# EAGLE design uSD_shield (EAGLE 6.2)
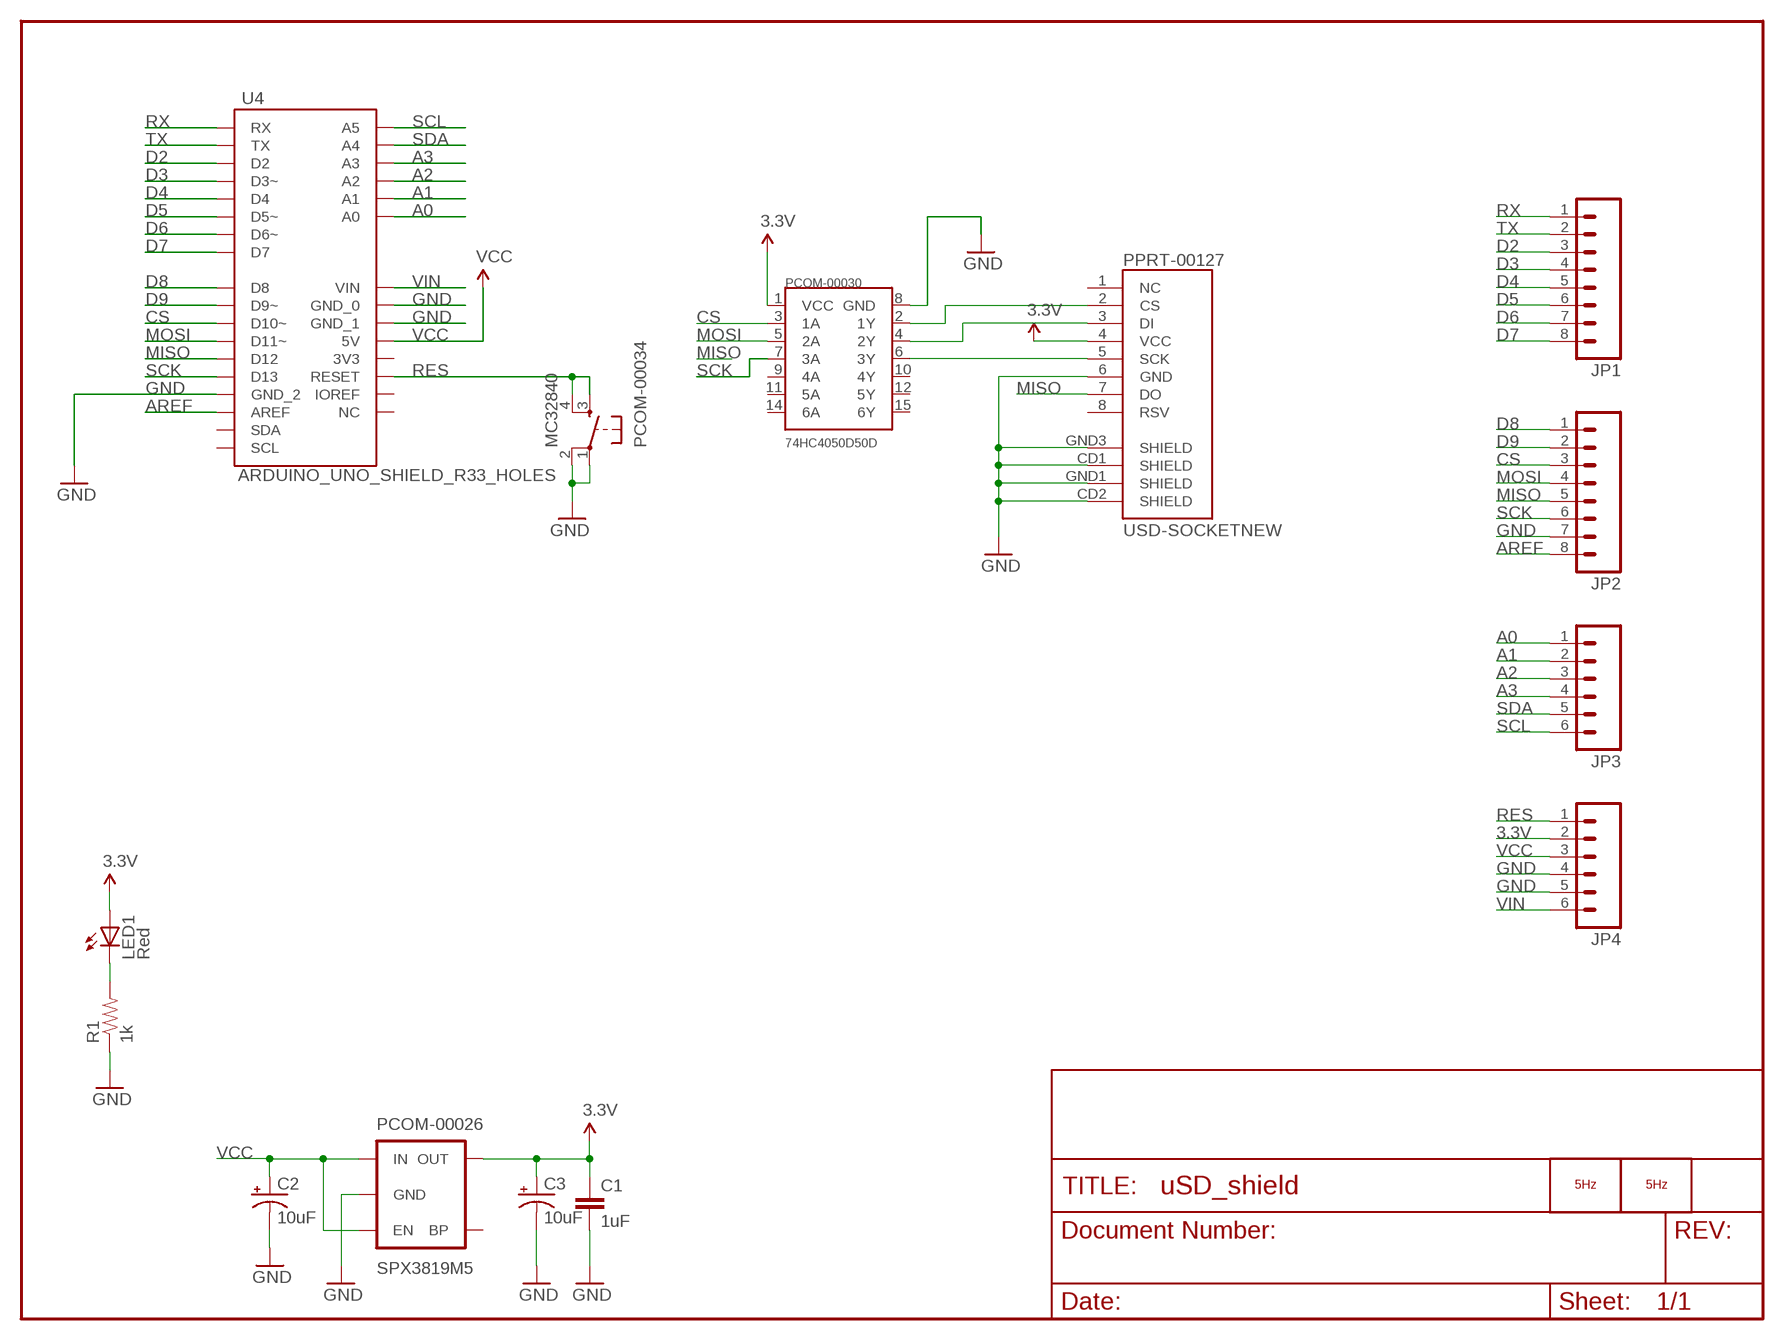
[diagram p0: schematic, sheet 1]

## Parts
C1  1uF  CAP0603-CAP  [0603-CAP]
C2  10uF  CAP_POL1206  [EIA3216]
C3  10uF  CAP_POL1206  [EIA3216]
JP1  M08  [1X08]
JP2  M08  [1X08]
JP3  M06SIP  [1X06]
JP4  M06SIP  [1X06]
LED1  Red  LED0603  [LED-0603]
LOGO2  LOGO_5HZ_MAIN_10MM  [5HZ_LOGO_MAIN_10MM]
LOGO3  LOGO_5HZ_H_COOPER_15MM  [5HZ_LOGO_H_COOPER_15MM]
PCOM-00026  SPX3819M5  V_REG_LDOSMD  [SOT23-5]
PCOM-00030  74HC4050D50D  HEX_CONVERTER  [SO016]
PCOM-00034  MC32840  TAC_SWITCHSMD  [TACTILE_SWITCH_SMD]
PPRT-00127  USD-SOCKETNEW  [MICRO-SD-SOCKET-PP]
R1  1k  RESISTOR0603-RES  [0603-RES]
U4  ARDUINO_UNO_SHIELD_R33_HOLES  [UNO_R3_SHIELD_3_HOLES_NO_SILK]

## Nets
3.3V: C1.1 C3.A(+) JP4.2 LED1.A PCOM-00026.5(OUT) PCOM-00030.1(VCC) PPRT-00127.4(VCC)
A0: JP3.1 U4.A0
A1: JP3.2 U4.A1
A2: JP3.3 U4.A2
A3: JP3.4 U4.A3
AREF: JP2.8 U4.AREF
CS: JP2.3 PCOM-00030.3(1A) U4.D10(D10~)
D2: JP1.3 U4.D2
D3: JP1.4 U4.D3(D3~)
D4: JP1.5 U4.D4
D5: JP1.6 U4.D5(D5~)
D6: JP1.7 U4.D6(D6~)
D7: JP1.8 U4.D7
D8: JP2.1 U4.D8
D9: JP2.2 U4.D9(D9~)
GND: C1.2 C2.C(-) C3.C(-) JP2.7 JP4.4 JP4.5 PCOM-00026.2(GND) PCOM-00030.8(GND) PCOM-00034.1 PCOM-00034.2 PPRT-00127.6(GND) PPRT-00127.CD1(SHIELD) PPRT-00127.CD2(SHIELD) PPRT-00127.GND1(SHIELD) PPRT-00127.GND3(SHIELD) R1.1 U4.GND_0 U4.GND_1 U4.GND_2
MISO: JP2.5 PPRT-00127.7(DO) U4.D12
MOSI: JP2.4 PCOM-00030.5(2A) U4.D11(D11~)
N$2: PCOM-00030.4(2Y) PPRT-00127.3(DI)
N$4: PCOM-00030.6(3Y) PPRT-00127.5(SCK)
N$6: LED1.C R1.2
N$163: PCOM-00030.2(1Y) PPRT-00127.2(CS)
RES: JP4.1 PCOM-00034.3 PCOM-00034.4 U4.RES(RESET)
RX: JP1.1 U4.RX
SCK: JP2.6 PCOM-00030.7(3A) U4.D13
SCL: JP3.6 U4.A5
SDA: JP3.5 U4.A4
TX: JP1.2 U4.TX
VCC: C2.A(+) JP4.3 PCOM-00026.1(IN) PCOM-00026.3(EN) U4.5V
VIN: JP4.6 U4.VIN
Unconnected: PCOM-00026.4(BP) PCOM-00030.9(4A) PCOM-00030.10(4Y) PCOM-00030.11(5A) PCOM-00030.12(5Y) PCOM-00030.14(6A) PCOM-00030.15(6Y) PPRT-00127.1(NC) PPRT-00127.8(RSV) U4.3.3V(3V3) U4.IOREF U4.NC U4.SCL U4.SDA

## Library data of the parts
C1 = SparkFun:CAP: Capacitor Standard 0603 ceramic capacitor, and 0.1" leaded capacitor.
C2 C3 = SparkFun:CAP_POL: Capacitor Polarized These are standard SMD and PTH capacitors. Normally 10uF, 47uF, and 100uF in electrolytic and tantalum varieties. Always verify the external diameter of the through hole cap, it varies with capacity, voltage, and manufacturer. The EIA devices should be standard.
JP1 JP2 = SparkFun:M08: Header 8 Standard 8-pin 0.1" header. Use with straight break away headers (SKU : PRT-00116), right angle break away headers (PRT-00553), swiss pins (PRT-00743), machine pins (PRT-00117), and female headers (PRT-00115).
JP3 JP4 = SparkFun:M06: Header 6 Standard 6-pin 0.1" header. Use with straight break away headers (SKU : PRT-00116), right angle break away headers (PRT-00553), swiss pins (PRT-00743), machine pins (PRT-00117), and female headers (PRT-00115). Molex polarized connector foot print use with SKU : PRT-08094 with associated crimp pins and housings. NOTES ON THE VARIANTS LOCK and LOCK_LONGPADS... This footprint was designed to help hold the alignment of a through-hole component (i.e. 6-pin header) while soldering it into place. You may notice that each hole has been shifted either up or down by 0.005 of an inch from it's more standard position (which is a perfectly straight line). This slight alteration caused the pins (the squares in the middle) to touch the edges of the holes. Because they are alternating, it causes a "brace" to hold the component in place. 0.005 has proven to be the perfect amount of "off-center" position when using our standard breakaway headers. Although looks a little odd when you look at the bare footprint, once you have a header in there, the alteration is very hard to notice. Also, if you push a header all the way into place, it is covered up entirely on the bottom side. This idea of altering the position of holes to aid alignment will be further integrated into the Sparkfun Library for other footprints. It can help hold any component with 3 or more connection pins.
LED1 = SparkFun:LED: LEDs Standard schematic elements and footprints for 5mm, 3mm, 1206, and 0603 sized LEDs. 5mm - Spark Fun Electronics SKU : COM-00529 (and others)
LOGO2 LOGO3 = 5hz-electronica:LOGO_5HZ: Logotipo 5Hz "según Pedro"
PCOM-00026 = SparkFun:V_REG_LDO: Voltage Regulator LDO Standard 150mA LDO voltage regulator in SOT-23 layout. Micrel part MIC5205. BP (by-pass) pin is used to lower output noise with 470pF cap.
PCOM-00030 = SparkFun:HEX_CONVERTER
PCOM-00034 = SparkFun:TAC_SWITCH: Momentary Switch Button commonly used for reset or general input. Spark Fun Electronics SKU : COM-00097
PPRT-00127 = SparkFun:USD-SOCKET: microSD Socket Push-push type uSD socket. Schematic element and footprint production proven. Spark Fun Electronics SKU : PRT-00127. tDoc lines correctly indicate media card edge positions when inserting (unlocked, locked, depressed).
R1 = SparkFun:RESISTOR: Resistor Basic schematic elements and footprints for 0603, 1206, and PTH 1/10th watt (small) resistors.
U4 = 5hz-electronica:ARDUINO_UNO_SHIELD_R3

## Board
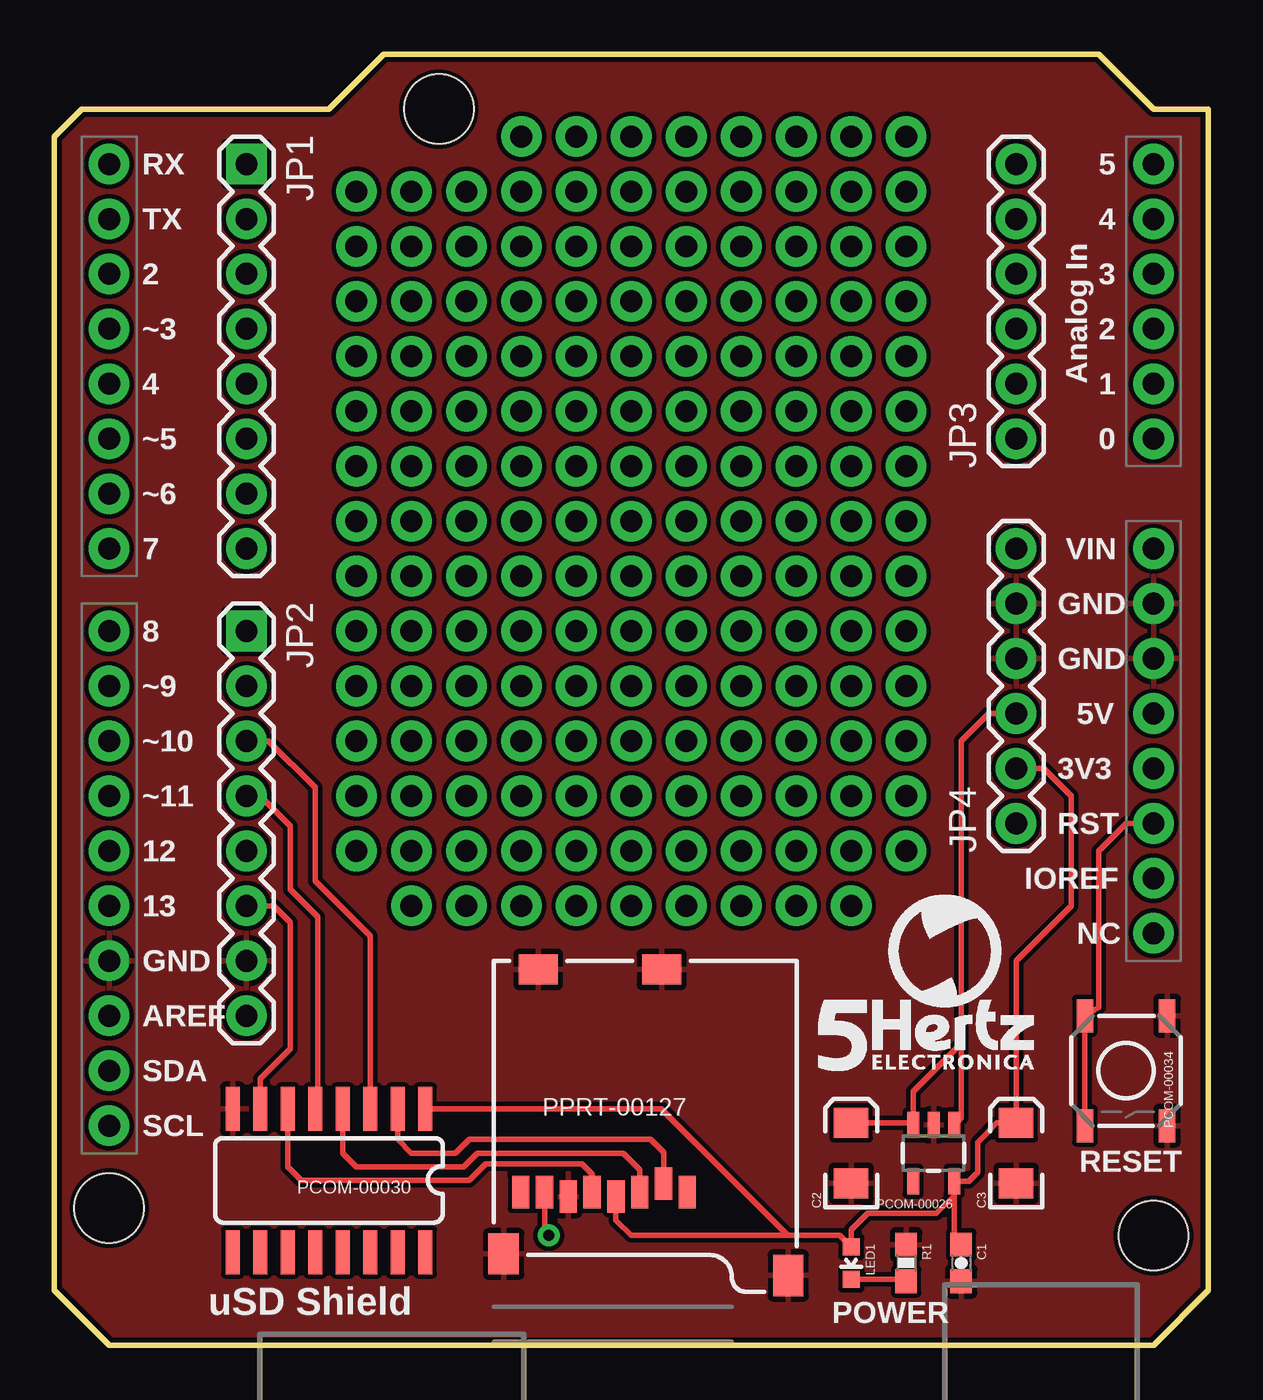
[diagram p1: board, top side]
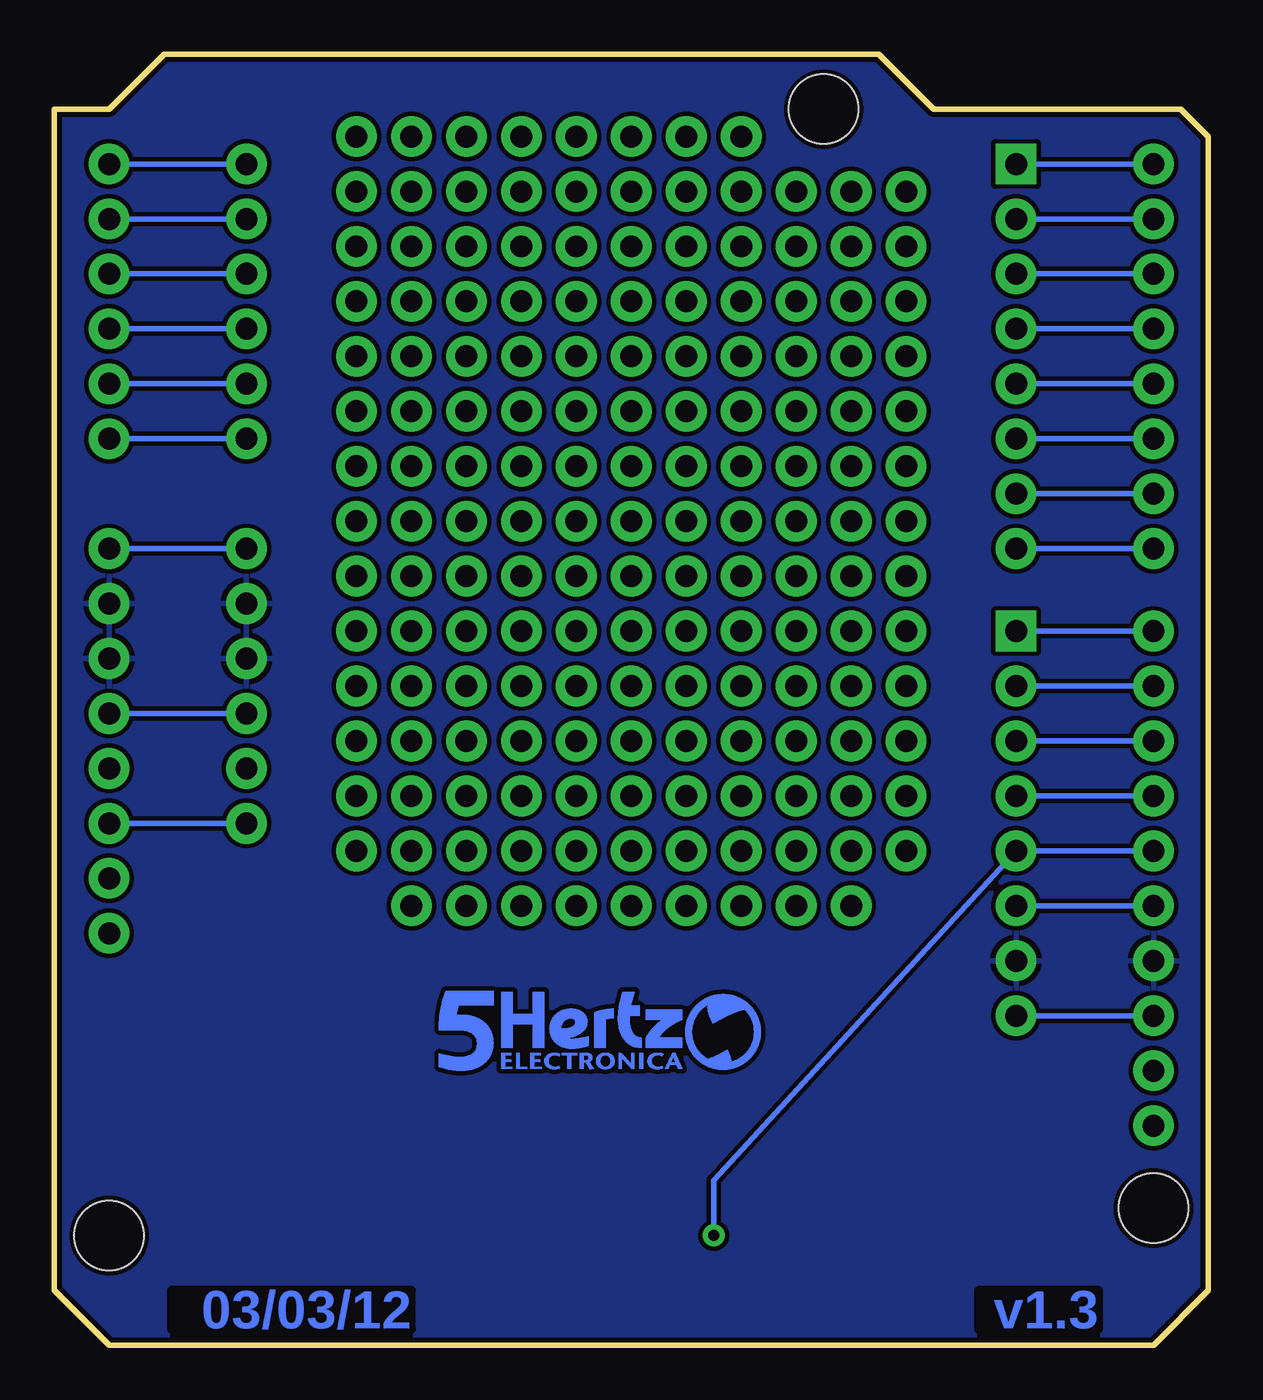
[diagram p2: board, bottom side, seen from below]

Size 53.34 x 59.69 mm. Coordinates in mm from the lower left corner, seen from the top.
Outline: 0,2.54 0,55.88 1.27,57.15 12.7,57.15 15.24,59.69 48.26,59.69 50.8,57.15 53.34,57.15 53.34,2.54 50.8,0 2.54,0 0,2.54
Copper layers (1*16): Top 0.035mm / dielectric 1.5mm / Bottom 0.035mm
Design rules: minimum track width 8mil, minimum drill 20mil, track to track 8mil, track to pad 8mil, pad to pad 8mil, via to via 8mil, smd to smd 8mil, copper to edge 9mil, drill to drill 8mil, minimum pad ring 12mil, minimum via ring 10mil, stop-mask expansion 4mil, vias tented up to drill 20mil, thermal gap 10mil

### Footprints (pad centres in the part's own frame; a part is rotated, then mirrored left to right if it is on the bottom)
0603-CAP = smd 1.1 x 1: 1 -0.85,0; 2 0.85,0
EIA3216 = smd 1.4 x 1.6: A 1.4,0; C -1.4,0
1X08 = drill 1.016 pad 1.88 square: 1 0,0 | drill 1.016 pad 1.88: 2 2.54,0; 3 5.08,0; 4 7.62,0; 5 10.16,0; 6 12.7,0; 7 15.24,0; 8 17.78,0
1X06 = drill 1.016 pad 1.88: 1 0,0; 2 2.54,0; 3 5.08,0; 4 7.62,0; 5 10.16,0; 6 12.7,0
LED-0603 = smd 0.8 x 0.8: A 0,-0.75; C 0,0.75
SOT23-5 = smd 0.55 x 1.2: 1 -0.95,-1.3; 2 0,-1.3; 3 0.95,-1.3; 4 0.95,1.3; 5 -0.95,1.3
SO016 = smd 0.66 x 2.032: 1 -4.445,-3.315; 2 -3.175,-3.315; 3 -1.905,-3.315; 4 -0.635,-3.315; 5 0.635,-3.315; 6 1.905,-3.315; 7 3.175,-3.315; 8 4.445,-3.315; 9 4.445,3.315; 10 3.175,3.315; 11 1.905,3.315; 12 0.635,3.315; 13 -0.635,3.315; 14 -1.905,3.315; 15 -3.175,3.315; 16 -4.445,3.315
TACTILE_SWITCH_SMD = smd 1.524 x 0.762: 1 -2.54,1.905; 2 2.54,1.905; 3 -2.54,-1.905; 4 2.54,-1.905
MICRO-SD-SOCKET-PP = smd 0.8 x 1.5: 1 -8.94,10.7; 2 -7.84,10.3; 3 -6.74,10.7; 4 -5.64,10.9; 5 -4.54,10.7; 6 -3.44,10.9; 7 -2.34,10.7; 8 -1.24,10.7 | smd 1.8 x 1.4: CD1 -2.05,0.4; CD2 -7.75,0.4 | smd 1.4 x 1.9: GND1 -13.6,14.55; GND3 -0.45,13.55
0603-RES = smd 1.1 x 1: 1 -0.85,0; 2 0.85,0
UNO_R3_SHIELD_3_HOLES_NO_SILK = drill 1.016 pad 1.88: 3.3V 26.67,2.54; 5V 29.21,2.54; A0 41.91,2.54; A1 44.45,2.54; A2 46.99,2.54; A3 49.53,2.54; A4 52.07,2.54; A5 54.61,2.54; AREF 15.24,50.8; D2 49.53,50.8; D3 46.99,50.8; D4 44.45,50.8; D5 41.91,50.8; D6 39.37,50.8; D7 36.83,50.8; D8 33.02,50.8; D9 30.48,50.8; D10 27.94,50.8; D11 25.4,50.8; D12 22.86,50.8; D13 20.32,50.8; GND_0 34.29,2.54; GND_1 31.75,2.54; GND_2 17.78,50.8; IOREF 21.59,2.54; NC 19.05,2.54; RES 24.13,2.54; RX 54.61,50.8; SCL 10.16,50.8; SDA 12.7,50.8; TX 52.07,50.8; VIN 36.83,2.54 | hole 3.2: 6.35,50.8; 5.08,2.54; 57.15,35.56

### Placement (x,y rotation side)
C1  41.91,3.81 270 top
C2  36.83,8.89 90 top
C3  44.45,8.89 90 top
JP1  8.89,54.61 270 top
JP2  8.89,33.02 270 top
JP3  44.45,41.91 90 top
JP4  44.45,24.13 90 top
LED1  36.83,3.81 180 top
LOGO2  35.31,12.7 0 top
LOGO3  35.56,12.7 0 bottom
PCOM-00026  40.64,8.89 180 top
PCOM-00030  12.7,7.62 180 top
PCOM-00034  49.53,12.7 270 top
PPRT-00127  20.32,17.78 180 top
R1  39.37,3.81 270 top
U4  53.34,0 90 top

### Tracks (layer width: path | path; a pad name or v marks a point on that pad's centre or on a via)
3.3V
  Top 0.254: PPRT-00127.4 25.96,5.79 26.67,5.08 33.91,5.08 | 33.91,5.08 36.31,5.08 LED1.A 36.83,5.33 37.59,6.1 40.77,6.1 41.59,6.92 PCOM-00026.5 | PCOM-00030.1 28.05,10.94 33.91,5.08 | PCOM-00026.5 41.59,4.98 C1.1 | PCOM-00026.5 42.26,7.59 42.67,8 42.67,9.4 43.56,10.29 C3.A 44.45,17.78 46.99,20.32 46.99,25.4 45.72,26.67 JP4.2
A0
  Bottom 0.254: JP3.1 U4.A0
A1
  Bottom 0.254: JP3.2 U4.A1
A2
  Bottom 0.254: JP3.3 U4.A2
A3
  Bottom 0.254: JP3.4 U4.A3
AREF
  Bottom 0.254: U4.AREF JP2.8
CS
  Top 0.254: PCOM-00030.3 14.61,12.95 14.61,13.34 14.61,18.92 12.06,21.46 12.06,25.78 9.91,27.94 JP2.3
  Bottom 0.254: JP2.3 U4.D10
D2
  Bottom 0.254: U4.D2 JP1.3
D3
  Bottom 0.254: U4.D3 JP1.4
D4
  Bottom 0.254: U4.D4 JP1.5
D5
  Bottom 0.254: U4.D5 JP1.6
D6
  Bottom 0.254: U4.D6 JP1.7
D7
  Bottom 0.254: U4.D7 JP1.8
D8  (via drill 0.51)
  Bottom 0.254: U4.D8 JP2.1
  other vias: 8.89,33.02
D9
  Bottom 0.254: U4.D9 JP2.2
GND
  pour Bottom: 2.54,0 0,2.54 0,55.88 1.27,57.15 12.7,57.15 15.24,59.69 48.26,59.69 50.8,57.15 53.34,57.15 53.34,2.54 50.8,0
  pour Top: 2.54,0 0,2.54 0,55.88 1.27,57.15 12.7,57.15 15.24,59.69 48.26,59.69 50.8,57.15 53.34,57.15 53.34,2.54 50.8,0
MISO  (via drill 0.51)
  Top 0.254: PPRT-00127.7 22.66,5.28 v22.86,5.08
  Bottom 0.254: v22.86,5.08 22.86,7.62 JP2.5 U4.D12
MOSI
  Top 0.254: JP2.4 9.53,25.4 10.92,24 10.92,21.08 12.19,19.81 12.19,11.06 PCOM-00030.5
  Bottom 0.254: JP2.4 U4.D11
N$1  (via drill 1.02 pad 1.88)
  other vias: 34.29,43.18
N$2
  Top 0.254: PPRT-00127.3 27.06,8.12 26.29,8.89 19.56,8.89 18.92,8.26 13.97,8.26 13.33,8.89 PCOM-00030.4
N$3  (via drill 1.02 pad 1.88)
  other vias: 34.29,35.56
N$4
  Top 0.254: PPRT-00127.5 24.86,7.91 24.38,8.38 19.94,8.38 19.18,7.62 11.43,7.62 10.79,8.26 PCOM-00030.6
N$5  (via drill 1.02 pad 1.88)
  other vias: 31.75,35.56
N$6
  Top 0.254: R1.2 39.37,3.17 39.26,3.06 LED1.C
N$7  (via drill 1.02 pad 1.88)
  other vias: 29.21,35.56
N$8  (via drill 1.02 pad 1.88)
  other vias: 31.75,43.18
N$9  (via drill 1.02 pad 1.88)
  other vias: 26.67,35.56
N$10  (via drill 1.02 pad 1.88)
  other vias: 24.13,35.56
N$11  (via drill 1.02 pad 1.88)
  other vias: 21.59,35.56
N$12  (via drill 1.02 pad 1.88)
  other vias: 19.05,35.56
N$13  (via drill 1.02 pad 1.88)
  other vias: 16.51,35.56
N$14  (via drill 1.02 pad 1.88)
  other vias: 39.37,30.48
N$15  (via drill 1.02 pad 1.88)
  other vias: 36.83,30.48
N$16  (via drill 1.02 pad 1.88)
  other vias: 36.83,27.94
N$17  (via drill 1.02 pad 1.88)
  other vias: 39.37,27.94
N$18  (via drill 1.02 pad 1.88)
  other vias: 39.37,25.4
N$19  (via drill 1.02 pad 1.88)
  other vias: 36.83,25.4
N$20  (via drill 1.02 pad 1.88)
  other vias: 36.83,22.86
N$21  (via drill 1.02 pad 1.88)
  other vias: 39.37,22.86
N$22  (via drill 1.02 pad 1.88)
  other vias: 13.97,35.56
N$23  (via drill 1.02 pad 1.88)
  other vias: 13.97,33.02
N$24  (via drill 1.02 pad 1.88)
  other vias: 16.51,33.02
N$25  (via drill 1.02 pad 1.88)
  other vias: 19.05,33.02
N$26  (via drill 1.02 pad 1.88)
  other vias: 21.59,33.02
N$27  (via drill 1.02 pad 1.88)
  other vias: 24.13,33.02
N$28  (via drill 1.02 pad 1.88)
  other vias: 26.67,33.02
N$29  (via drill 1.02 pad 1.88)
  other vias: 29.21,33.02
N$30  (via drill 1.02 pad 1.88)
  other vias: 29.21,43.18
N$31  (via drill 1.02 pad 1.88)
  other vias: 31.75,33.02
N$32  (via drill 1.02 pad 1.88)
  other vias: 34.29,33.02
N$33  (via drill 1.02 pad 1.88)
  other vias: 39.37,35.56
N$34  (via drill 1.02 pad 1.88)
  other vias: 36.83,35.56
N$35  (via drill 1.02 pad 1.88)
  other vias: 36.83,33.02
N$36  (via drill 1.02 pad 1.88)
  other vias: 39.37,33.02
N$37  (via drill 1.02 pad 1.88)
  other vias: 34.29,38.1
N$38  (via drill 1.02 pad 1.88)
  other vias: 31.75,38.1
N$39  (via drill 1.02 pad 1.88)
  other vias: 29.21,38.1
N$40  (via drill 1.02 pad 1.88)
  other vias: 26.67,38.1
N$41  (via drill 1.02 pad 1.88)
  other vias: 24.13,38.1
N$42  (via drill 1.02 pad 1.88)
  other vias: 21.59,38.1
N$43  (via drill 1.02 pad 1.88)
  other vias: 19.05,38.1
N$44  (via drill 1.02 pad 1.88)
  other vias: 16.51,38.1
N$45  (via drill 1.02 pad 1.88)
  other vias: 13.97,38.1
N$46  (via drill 1.02 pad 1.88)
  other vias: 39.37,38.1
N$47  (via drill 1.02 pad 1.88)
  other vias: 36.83,38.1
N$48  (via drill 1.02 pad 1.88)
  other vias: 26.67,43.18
N$49  (via drill 1.02 pad 1.88)
  other vias: 24.13,43.18
N$50  (via drill 1.02 pad 1.88)
  other vias: 21.59,43.18
N$51  (via drill 1.02 pad 1.88)
  other vias: 19.05,43.18
N$52  (via drill 1.02 pad 1.88)
  other vias: 16.51,43.18
N$53  (via drill 1.02 pad 1.88)
  other vias: 13.97,43.18
N$54  (via drill 1.02 pad 1.88)
  other vias: 13.97,40.64
N$55  (via drill 1.02 pad 1.88)
  other vias: 16.51,40.64
N$56  (via drill 1.02 pad 1.88)
  other vias: 19.05,40.64
N$57  (via drill 1.02 pad 1.88)
  other vias: 21.59,40.64
N$58  (via drill 1.02 pad 1.88)
  other vias: 24.13,40.64
N$59  (via drill 1.02 pad 1.88)
  other vias: 26.67,40.64
N$60  (via drill 1.02 pad 1.88)
  other vias: 29.21,40.64
N$61  (via drill 1.02 pad 1.88)
  other vias: 31.75,40.64
N$62  (via drill 1.02 pad 1.88)
  other vias: 34.29,40.64
N$63  (via drill 1.02 pad 1.88)
  other vias: 39.37,43.18
N$64  (via drill 1.02 pad 1.88)
  other vias: 36.83,43.18
N$65  (via drill 1.02 pad 1.88)
  other vias: 36.83,40.64
N$66  (via drill 1.02 pad 1.88)
  other vias: 39.37,40.64
N$67  (via drill 1.02 pad 1.88)
  other vias: 34.29,45.72
N$68  (via drill 1.02 pad 1.88)
  other vias: 31.75,45.72
N$69  (via drill 1.02 pad 1.88)
  other vias: 29.21,45.72
N$70  (via drill 1.02 pad 1.88)
  other vias: 26.67,45.72
N$71  (via drill 1.02 pad 1.88)
  other vias: 24.13,45.72
N$72  (via drill 1.02 pad 1.88)
  other vias: 21.59,45.72
N$73  (via drill 1.02 pad 1.88)
  other vias: 19.05,45.72
N$74  (via drill 1.02 pad 1.88)
  other vias: 16.51,45.72
N$75  (via drill 1.02 pad 1.88)
  other vias: 13.97,45.72
N$76  (via drill 1.02 pad 1.88)
  other vias: 39.37,45.72
N$77  (via drill 1.02 pad 1.88)
  other vias: 36.83,45.72
N$78  (via drill 1.02 pad 1.88)
  other vias: 34.29,48.26
N$79  (via drill 1.02 pad 1.88)
  other vias: 31.75,48.26
N$80  (via drill 1.02 pad 1.88)
  other vias: 29.21,48.26
N$81  (via drill 1.02 pad 1.88)
  other vias: 26.67,48.26
N$82  (via drill 1.02 pad 1.88)
  other vias: 24.13,48.26
N$83  (via drill 1.02 pad 1.88)
  other vias: 21.59,48.26
N$84  (via drill 1.02 pad 1.88)
  other vias: 19.05,48.26
N$85  (via drill 1.02 pad 1.88)
  other vias: 16.51,48.26
N$86  (via drill 1.02 pad 1.88)
  other vias: 13.97,48.26
N$87  (via drill 1.02 pad 1.88)
  other vias: 39.37,48.26
N$88  (via drill 1.02 pad 1.88)
  other vias: 36.83,48.26
N$89  (via drill 1.02 pad 1.88)
  other vias: 34.29,50.8
N$90  (via drill 1.02 pad 1.88)
  other vias: 31.75,50.8
N$91  (via drill 1.02 pad 1.88)
  other vias: 29.21,50.8
N$92  (via drill 1.02 pad 1.88)
  other vias: 26.67,50.8
N$93  (via drill 1.02 pad 1.88)
  other vias: 24.13,50.8
N$94  (via drill 1.02 pad 1.88)
  other vias: 21.59,50.8
N$95  (via drill 1.02 pad 1.88)
  other vias: 19.05,50.8
N$96  (via drill 1.02 pad 1.88)
  other vias: 16.51,50.8
N$97  (via drill 1.02 pad 1.88)
  other vias: 13.97,50.8
N$98  (via drill 1.02 pad 1.88)
  other vias: 39.37,50.8
N$99  (via drill 1.02 pad 1.88)
  other vias: 36.83,50.8
N$100  (via drill 1.02 pad 1.88)
  other vias: 34.29,55.88
N$101  (via drill 1.02 pad 1.88)
  other vias: 31.75,55.88
N$102  (via drill 1.02 pad 1.88)
  other vias: 29.21,55.88
N$103  (via drill 1.02 pad 1.88)
  other vias: 26.67,55.88
N$104  (via drill 1.02 pad 1.88)
  other vias: 24.13,55.88
N$105  (via drill 1.02 pad 1.88)
  other vias: 21.59,55.88
N$106  (via drill 1.02 pad 1.88)
  other vias: 19.05,53.34
N$107  (via drill 1.02 pad 1.88)
  other vias: 16.51,53.34
N$108  (via drill 1.02 pad 1.88)
  other vias: 13.97,53.34
N$109  (via drill 1.02 pad 1.88)
  other vias: 39.37,55.88
N$110  (via drill 1.02 pad 1.88)
  other vias: 36.83,55.88
N$111  (via drill 1.02 pad 1.88)
  other vias: 21.59,53.34
N$112  (via drill 1.02 pad 1.88)
  other vias: 26.67,53.34
N$113  (via drill 1.02 pad 1.88)
  other vias: 29.21,53.34
N$114  (via drill 1.02 pad 1.88)
  other vias: 31.75,53.34
N$115  (via drill 1.02 pad 1.88)
  other vias: 34.29,30.48
N$116  (via drill 1.02 pad 1.88)
  other vias: 31.75,30.48
N$117  (via drill 1.02 pad 1.88)
  other vias: 29.21,30.48
N$118  (via drill 1.02 pad 1.88)
  other vias: 26.67,30.48
N$119  (via drill 1.02 pad 1.88)
  other vias: 24.13,30.48
N$120  (via drill 1.02 pad 1.88)
  other vias: 21.59,30.48
N$121  (via drill 1.02 pad 1.88)
  other vias: 19.05,30.48
N$122  (via drill 1.02 pad 1.88)
  other vias: 16.51,30.48
N$123  (via drill 1.02 pad 1.88)
  other vias: 13.97,30.48
N$124  (via drill 1.02 pad 1.88)
  other vias: 13.97,27.94
N$125  (via drill 1.02 pad 1.88)
  other vias: 16.51,27.94
N$126  (via drill 1.02 pad 1.88)
  other vias: 19.05,27.94
N$127  (via drill 1.02 pad 1.88)
  other vias: 21.59,27.94
N$128  (via drill 1.02 pad 1.88)
  other vias: 24.13,27.94
N$129  (via drill 1.02 pad 1.88)
  other vias: 26.67,27.94
N$130  (via drill 1.02 pad 1.88)
  other vias: 29.21,27.94
N$131  (via drill 1.02 pad 1.88)
  other vias: 31.75,27.94
N$132  (via drill 1.02 pad 1.88)
  other vias: 34.29,27.94
N$133  (via drill 1.02 pad 1.88)
  other vias: 34.29,53.34
N$134  (via drill 1.02 pad 1.88)
  other vias: 36.83,53.34
N$135  (via drill 1.02 pad 1.88)
  other vias: 39.37,53.34
N$136  (via drill 1.02 pad 1.88)
  other vias: 16.51,20.32
N$137  (via drill 1.02 pad 1.88)
  other vias: 19.05,20.32
N$138  (via drill 1.02 pad 1.88)
  other vias: 21.59,20.32
N$139  (via drill 1.02 pad 1.88)
  other vias: 24.13,20.32
N$140  (via drill 1.02 pad 1.88)
  other vias: 26.67,20.32
N$141  (via drill 1.02 pad 1.88)
  other vias: 34.29,25.4
N$142  (via drill 1.02 pad 1.88)
  other vias: 31.75,25.4
N$143  (via drill 1.02 pad 1.88)
  other vias: 29.21,25.4
N$144  (via drill 1.02 pad 1.88)
  other vias: 26.67,25.4
N$145  (via drill 1.02 pad 1.88)
  other vias: 24.13,25.4
N$146  (via drill 1.02 pad 1.88)
  other vias: 21.59,25.4
N$147  (via drill 1.02 pad 1.88)
  other vias: 19.05,25.4
N$148  (via drill 1.02 pad 1.88)
  other vias: 16.51,25.4
N$149  (via drill 1.02 pad 1.88)
  other vias: 13.97,25.4
N$150  (via drill 1.02 pad 1.88)
  other vias: 13.97,22.86
N$151  (via drill 1.02 pad 1.88)
  other vias: 16.51,22.86
N$152  (via drill 1.02 pad 1.88)
  other vias: 19.05,22.86
N$153  (via drill 1.02 pad 1.88)
  other vias: 21.59,22.86
N$154  (via drill 1.02 pad 1.88)
  other vias: 24.13,22.86
N$155  (via drill 1.02 pad 1.88)
  other vias: 26.67,22.86
N$156  (via drill 1.02 pad 1.88)
  other vias: 29.21,22.86
N$157  (via drill 1.02 pad 1.88)
  other vias: 31.75,22.86
N$158  (via drill 1.02 pad 1.88)
  other vias: 34.29,22.86
N$159  (via drill 1.02 pad 1.88)
  other vias: 29.21,20.32
N$160  (via drill 1.02 pad 1.88)
  other vias: 31.75,20.32
N$161  (via drill 1.02 pad 1.88)
  other vias: 34.29,20.32
N$162  (via drill 1.02 pad 1.88)
  other vias: 36.83,20.32
N$163
  Top 0.254: PPRT-00127.2 28.16,8.92 27.56,9.53 19.18,9.53 18.54,8.89 16.51,8.89 15.88,9.53 PCOM-00030.2
N$164  (via drill 1.02 pad 1.88)
  other vias: 24.13,53.34
RES
  Top 0.254: U4.RES 49.53,24.13 48.26,22.86 48.26,15.62 PCOM-00034.3 PCOM-00034.4
  Bottom 0.254: U4.RES JP4.1
RX
  Bottom 0.254: 6.35,54.61 JP1.1 U4.RX
SCK
  Top 0.254: U4.D13 2.79,20.32 | PCOM-00030.7 9.53,12.32 10.92,13.72 10.92,19.56 10.16,20.32 JP2.6
  Bottom 0.254: JP2.6 U4.D13
SCL
  Bottom 0.254: JP3.6 U4.A5
SDA
  Bottom 0.254: JP3.5 U4.A4
TX
  Bottom 0.254: U4.TX JP1.2
VCC
  Top 0.254: JP4.3 43.18,29.21 41.91,27.94 41.91,13.97 | 41.91,13.97 41.91,10.51 PCOM-00026.1 | C2.A 39.59,10.29 PCOM-00026.3 39.69,11.75 41.91,13.97
  Bottom 0.254: JP4.3 U4.5V
VIN
  Bottom 0.254: JP4.6 U4.VIN

### Text on the board
Bottom: v1.3 | 03/03/12
tPlace: RX | 5 | TX | 4 | 2 | 3 | ~3 | 2 | 4 | Analog In | 1 | ~5 | 0 | ~6 | 7 | VIN | GND | 8 | GND | ~9 | 5V | ~10 | 3V3 | ~11 | RST | 12 | IOREF | 13 | NC | GND | AREF | SDA | SCL | RESET | uSD Shield | POWER